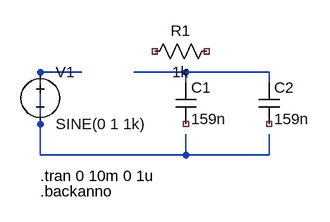
[diagram p0: schematic rc_tiefpass_2ord.asc]
rc_tiefpass_2ord.asc, the LTspice schematic file:
Version 4
SHEET 1 880 680
WIRE 112 160 48 160
WIRE 272 160 192 160
WIRE 272 176 272 160
WIRE 400 160 272 160
WIRE 400 176 400 160
WIRE 272 288 272 256
WIRE 400 288 400 256
WIRE 272 288 400 288
WIRE 48 288 48 160
WIRE 48 288 272 288
SYMBOL res 208 144 R270
WINDOW 0 32 56 VTop 2
WINDOW 3 0 56 VBottom 2
SYMATTR InstName R1
SYMATTR Value 1k
SYMBOL cap 256 176 R0
SYMATTR InstName C1
SYMATTR Value 159n
SYMBOL cap 384 176 R0
SYMATTR InstName C2
SYMATTR Value 159n
SYMBOL voltage 48 144 R0
WINDOW 123 0 0 Left 0
WINDOW 39 0 0 Left 0
SYMATTR InstName V1
SYMATTR Value SINE(0 1 1k)
TEXT 48 320 Left 2 !.tran 0 10m 0 1u
TEXT 48 344 Left 2 !.backanno

The netlist it stands for:
* rc_tiefpass_2ord.asc
R1 NC_01 NC_02 1k
C1 N002 NC_03 159n
C2 N002 NC_04 159n
V1 N001 N001 SINE(0 1 1k)
.tran 0 10m 0 1u
.backanno
.backanno
.end